# Altium schematic sheet fpga13-serdes-power.SchDoc
size Tabloid; SheetNumber: 48; SheetTotal: 71
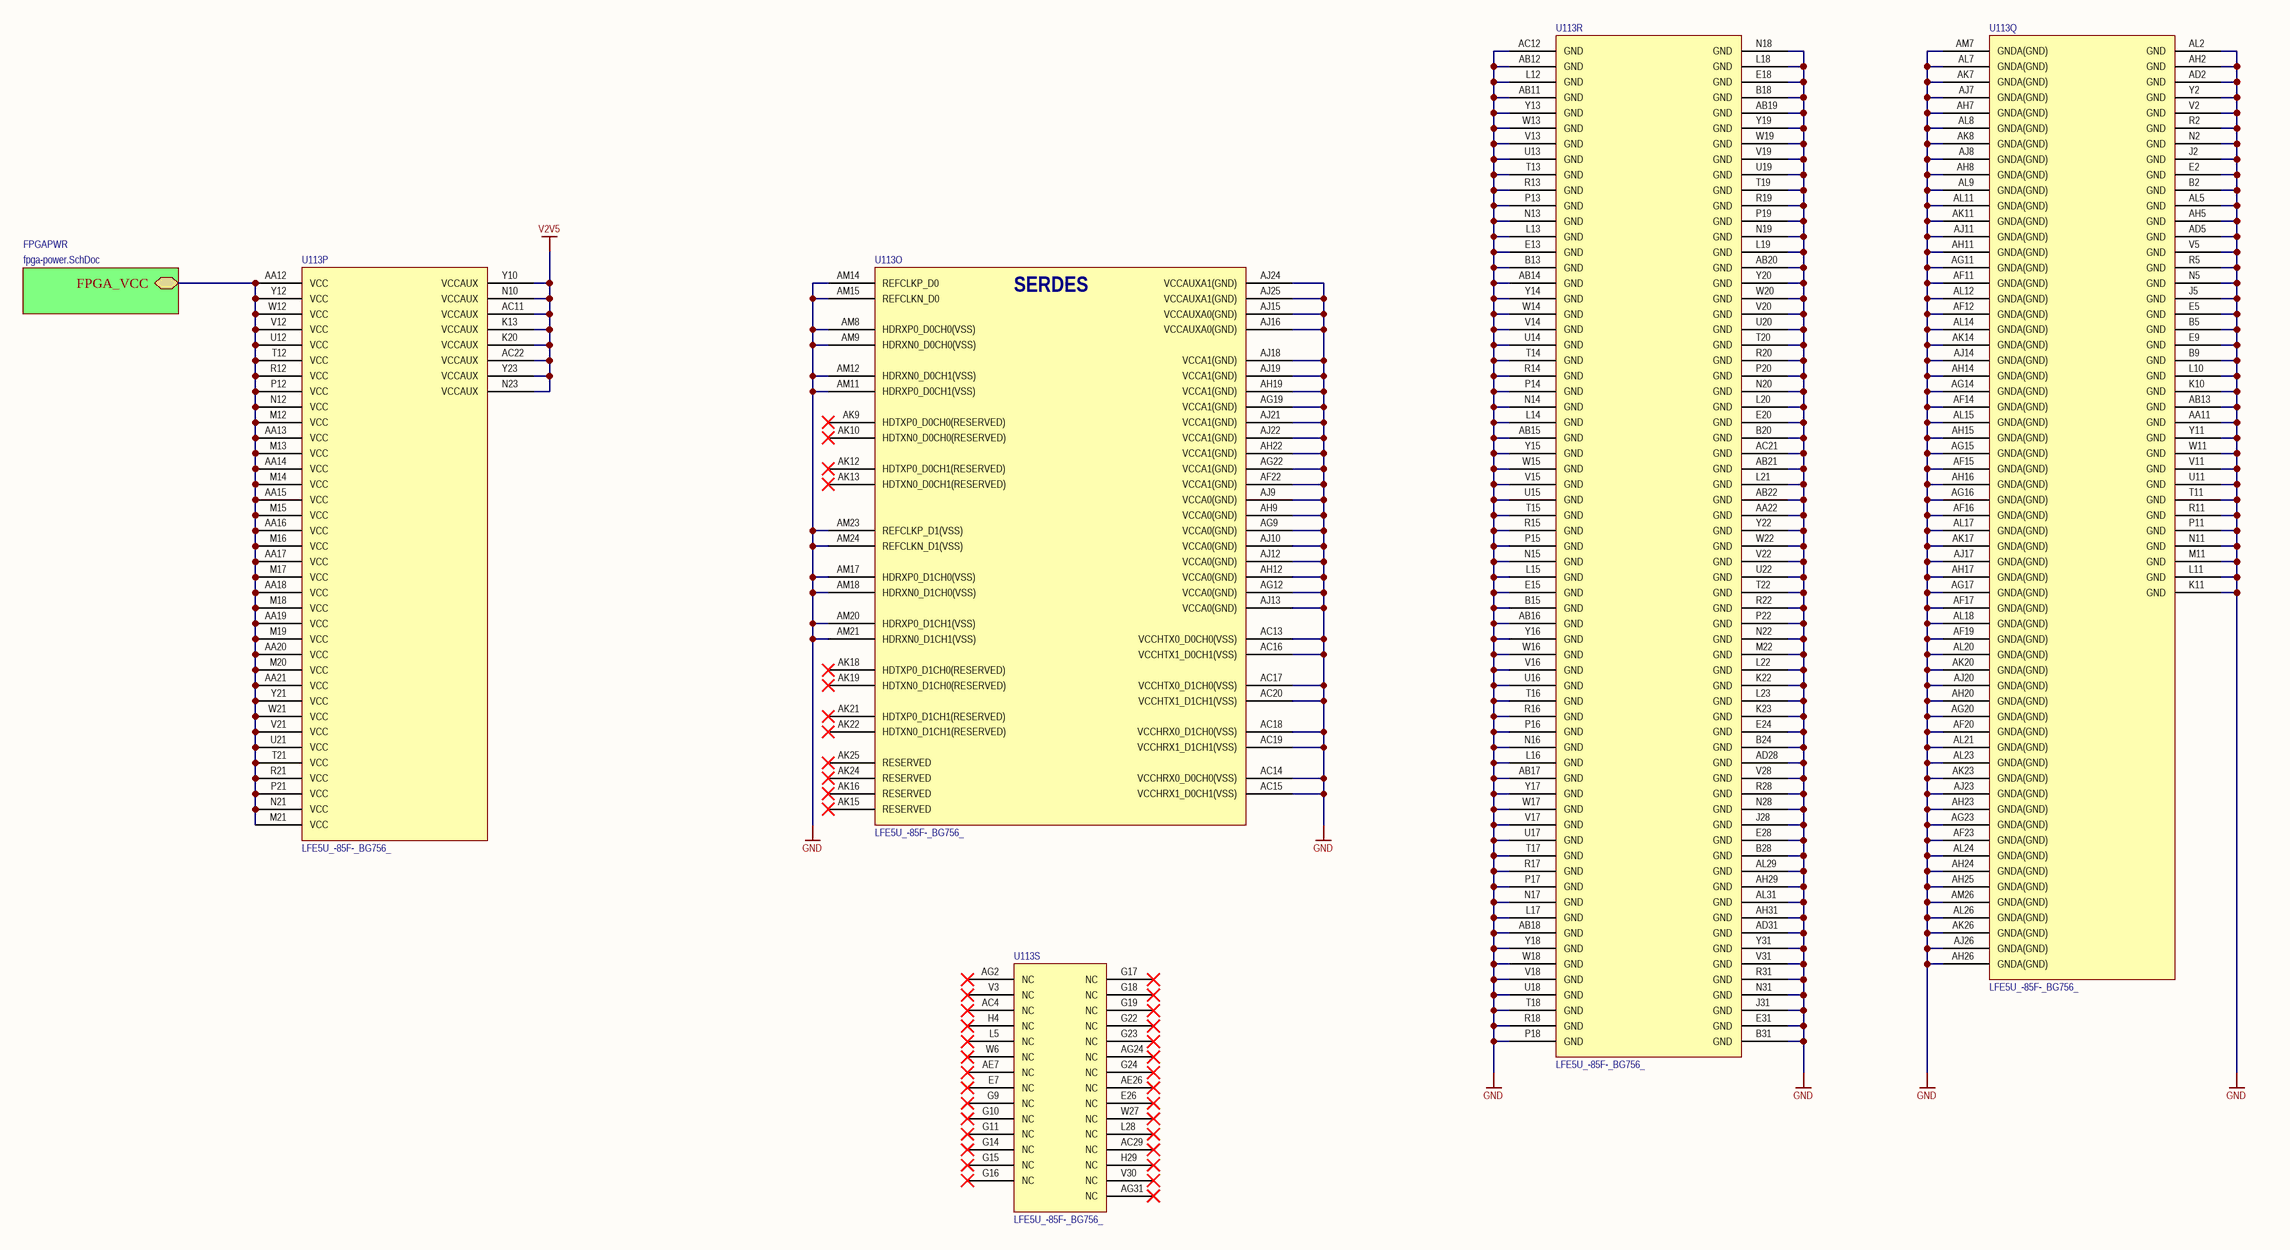
[diagram p0: fpga13-serdes-power.SchDoc]

## Parts
U113  LFE5U_-85F-_BG756_  [caBGA756]  (parts O,P,Q,R,S of 19)

## Sub-sheets
FPGAPWR = fpga-power.SchDoc: FPGA_VCC

## Nets
GND: U113.AA11(GND) U113.AA22(GND) U113.AB11(GND) U113.AB12(GND) U113.AB13(GND) U113.AB14(GND) U113.AB15(GND) U113.AB16(GND) U113.AB17(GND) U113.AB18(GND) U113.AB19(GND) U113.AB20(GND) U113.AB21(GND) U113.AB22(GND) U113.AC12(GND) U113.AC13(VCCHTX0_D0CH0(VSS)) U113.AC14(VCCHRX0_D0CH0(VSS)) U113.AC15(VCCHRX1_D0CH1(VSS)) U113.AC16(VCCHTX1_D0CH1(VSS)) U113.AC17(VCCHTX0_D1CH0(VSS)) U113.AC18(VCCHRX0_D1CH0(VSS)) U113.AC19(VCCHRX1_D1CH1(VSS)) U113.AC20(VCCHTX1_D1CH1(VSS)) U113.AC21(GND) U113.AD2(GND) U113.AD5(GND) U113.AD28(GND) U113.AD31(GND) U113.AF11(GNDA(GND)) U113.AF12(GNDA(GND)) U113.AF14(GNDA(GND)) U113.AF15(GNDA(GND)) U113.AF16(GNDA(GND)) U113.AF17(GNDA(GND)) U113.AF19(GNDA(GND)) U113.AF20(GNDA(GND)) U113.AF22(VCCA1(GND)) U113.AF23(GNDA(GND)) U113.AG9(VCCA0(GND)) U113.AG11(GNDA(GND)) U113.AG12(VCCA0(GND)) U113.AG14(GNDA(GND)) U113.AG15(GNDA(GND)) U113.AG16(GNDA(GND)) U113.AG17(GNDA(GND)) U113.AG19(VCCA1(GND)) U113.AG20(GNDA(GND)) U113.AG22(VCCA1(GND)) U113.AG23(GNDA(GND)) U113.AH2(GND) U113.AH5(GND) U113.AH7(GNDA(GND)) U113.AH8(GNDA(GND)) U113.AH9(VCCA0(GND)) U113.AH11(GNDA(GND)) U113.AH12(VCCA0(GND)) U113.AH14(GNDA(GND)) U113.AH15(GNDA(GND)) U113.AH16(GNDA(GND)) U113.AH17(GNDA(GND)) U113.AH19(VCCA1(GND)) U113.AH20(GNDA(GND)) U113.AH22(VCCA1(GND)) U113.AH23(GNDA(GND)) U113.AH24(GNDA(GND)) U113.AH25(GNDA(GND)) U113.AH26(GNDA(GND)) U113.AH29(GND) U113.AH31(GND) U113.AJ7(GNDA(GND)) U113.AJ8(GNDA(GND)) U113.AJ9(VCCA0(GND)) U113.AJ10(VCCA0(GND)) U113.AJ11(GNDA(GND)) U113.AJ12(VCCA0(GND)) U113.AJ13(VCCA0(GND)) U113.AJ14(GNDA(GND)) U113.AJ15(VCCAUXA0(GND)) U113.AJ16(VCCAUXA0(GND)) U113.AJ17(GNDA(GND)) U113.AJ18(VCCA1(GND)) U113.AJ19(VCCA1(GND)) U113.AJ20(GNDA(GND)) U113.AJ21(VCCA1(GND)) U113.AJ22(VCCA1(GND)) U113.AJ23(GNDA(GND)) U113.AJ24(VCCAUXA1(GND)) U113.AJ25(VCCAUXA1(GND)) U113.AJ26(GNDA(GND)) U113.AK7(GNDA(GND)) U113.AK8(GNDA(GND)) U113.AK11(GNDA(GND)) U113.AK14(GNDA(GND)) U113.AK17(GNDA(GND)) U113.AK20(GNDA(GND)) U113.AK23(GNDA(GND)) U113.AK26(GNDA(GND)) U113.AL2(GND) U113.AL5(GND) U113.AL7(GNDA(GND)) U113.AL8(GNDA(GND)) U113.AL9(GNDA(GND)) U113.AL11(GNDA(GND)) U113.AL12(GNDA(GND)) U113.AL14(GNDA(GND)) U113.AL15(GNDA(GND)) U113.AL17(GNDA(GND)) U113.AL18(GNDA(GND)) U113.AL20(GNDA(GND)) U113.AL21(GNDA(GND)) U113.AL23(GNDA(GND)) U113.AL24(GNDA(GND)) U113.AL26(GNDA(GND)) U113.AL29(GND) U113.AL31(GND) U113.AM7(GNDA(GND)) U113.AM8(HDRXP0_D0CH0(VSS)) U113.AM9(HDRXN0_D0CH0(VSS)) U113.AM11(HDRXP0_D0CH1(VSS)) U113.AM12(HDRXN0_D0CH1(VSS)) U113.AM14(REFCLKP_D0) U113.AM15(REFCLKN_D0) U113.AM17(HDRXP0_D1CH0(VSS)) U113.AM18(HDRXN0_D1CH0(VSS)) U113.AM20(HDRXP0_D1CH1(VSS)) U113.AM21(HDRXN0_D1CH1(VSS)) U113.AM23(REFCLKP_D1(VSS)) U113.AM24(REFCLKN_D1(VSS)) U113.AM26(GNDA(GND)) U113.B2(GND) U113.B5(GND) U113.B9(GND) U113.B13(GND) U113.B15(GND) U113.B18(GND) U113.B20(GND) U113.B24(GND) U113.B28(GND) U113.B31(GND) U113.E2(GND) U113.E5(GND) U113.E9(GND) U113.E13(GND) U113.E15(GND) U113.E18(GND) U113.E20(GND) U113.E24(GND) U113.E28(GND) U113.E31(GND) U113.J2(GND) U113.J5(GND) U113.J28(GND) U113.J31(GND) U113.K10(GND) U113.K11(GND) U113.K22(GND) U113.K23(GND) U113.L10(GND) U113.L11(GND) U113.L12(GND) U113.L13(GND) U113.L14(GND) U113.L15(GND) U113.L16(GND) U113.L17(GND) U113.L18(GND) U113.L19(GND) U113.L20(GND) U113.L21(GND) U113.L22(GND) U113.L23(GND) U113.M11(GND) U113.M22(GND) U113.N2(GND) U113.N5(GND) U113.N11(GND) U113.N13(GND) U113.N14(GND) U113.N15(GND) U113.N16(GND) U113.N17(GND) U113.N18(GND) U113.N19(GND) U113.N20(GND) U113.N22(GND) U113.N28(GND) U113.N31(GND) U113.P11(GND) U113.P13(GND) U113.P14(GND) U113.P15(GND) U113.P16(GND) U113.P17(GND) U113.P18(GND) U113.P19(GND) U113.P20(GND) U113.P22(GND) U113.R2(GND) U113.R5(GND) U113.R11(GND) U113.R13(GND) U113.R14(GND) U113.R15(GND) U113.R16(GND) U113.R17(GND) U113.R18(GND) U113.R19(GND) U113.R20(GND) U113.R22(GND) U113.R28(GND) U113.R31(GND) U113.T11(GND) U113.T13(GND) U113.T14(GND) U113.T15(GND) U113.T16(GND) U113.T17(GND) U113.T18(GND) U113.T19(GND) U113.T20(GND) U113.T22(GND) U113.U11(GND) U113.U13(GND) U113.U14(GND) U113.U15(GND) U113.U16(GND) U113.U17(GND) U113.U18(GND) U113.U19(GND) U113.U20(GND) U113.U22(GND) U113.V2(GND) U113.V5(GND) U113.V11(GND) U113.V13(GND) U113.V14(GND) U113.V15(GND) U113.V16(GND) U113.V17(GND) U113.V18(GND) U113.V19(GND) U113.V20(GND) U113.V22(GND) U113.V28(GND) U113.V31(GND) U113.W11(GND) U113.W13(GND) U113.W14(GND) U113.W15(GND) U113.W16(GND) U113.W17(GND) U113.W18(GND) U113.W19(GND) U113.W20(GND) U113.W22(GND) U113.Y2(GND) U113.Y11(GND) U113.Y13(GND) U113.Y14(GND) U113.Y15(GND) U113.Y16(GND) U113.Y17(GND) U113.Y18(GND) U113.Y19(GND) U113.Y20(GND) U113.Y22(GND) U113.Y31(GND)
V2V5: U113.AC11(VCCAUX) U113.AC22(VCCAUX) U113.K13(VCCAUX) U113.K20(VCCAUX) U113.N10(VCCAUX) U113.N23(VCCAUX) U113.Y10(VCCAUX) U113.Y23(VCCAUX)
NetU113_AA12: U113.AA12(VCC) U113.AA13(VCC) U113.AA14(VCC) U113.AA15(VCC) U113.AA16(VCC) U113.AA17(VCC) U113.AA18(VCC) U113.AA19(VCC) U113.AA20(VCC) U113.AA21(VCC) U113.M12(VCC) U113.M13(VCC) U113.M14(VCC) U113.M15(VCC) U113.M16(VCC) U113.M17(VCC) U113.M18(VCC) U113.M19(VCC) U113.M20(VCC) U113.M21(VCC) U113.N12(VCC) U113.N21(VCC) U113.P12(VCC) U113.P21(VCC) U113.R12(VCC) U113.R21(VCC) U113.T12(VCC) U113.T21(VCC) U113.U12(VCC) U113.U21(VCC) U113.V12(VCC) U113.V21(VCC) U113.W12(VCC) U113.W21(VCC) U113.Y12(VCC) U113.Y21(VCC) ; sheet FPGAPWR/FPGA_VCC

Not connected (* = marked no-connect by the designer): U113 AC4(NC)* AC29(NC)* AE7(NC)* AE26(NC)* AG2(NC)* AG24(NC)* AG31(NC)* AK9(HDTXP0_D0CH0(RESERVED))* AK10(HDTXN0_D0CH0(RESERVED))* AK12(HDTXP0_D0CH1(RESERVED))* AK13(HDTXN0_D0CH1(RESERVED))* AK15(RESERVED)* AK16(RESERVED)* AK18(HDTXP0_D1CH0(RESERVED))* AK19(HDTXN0_D1CH0(RESERVED))* AK21(HDTXP0_D1CH1(RESERVED))* AK22(HDTXN0_D1CH1(RESERVED))* AK24(RESERVED)* AK25(RESERVED)* E7(NC)* E26(NC)* G9(NC)* G10(NC)* G11(NC)* G14(NC)* G15(NC)* G16(NC)* G17(NC)* G18(NC)* G19(NC)* G22(NC)* G23(NC)* G24(NC)* H4(NC)* H29(NC)* L5(NC)* L28(NC)* V3(NC)* V30(NC)* W6(NC)* W27(NC)*

## Notes on the sheet
- (in symbol LFE5U_-85F-_BG756_, part O) SERDES

## Library data of the parts
U113 = LFE5U_-85F-_BG756_: ECP5 FPGA, 85k LUT, 756-caBGA; Manufacturer: Lattice Semiconductor; Manufacturer P/N: LFE5U_-85F-_BG756_